# Altium schematic sheet CET-124-120W.SchDoc
size A4
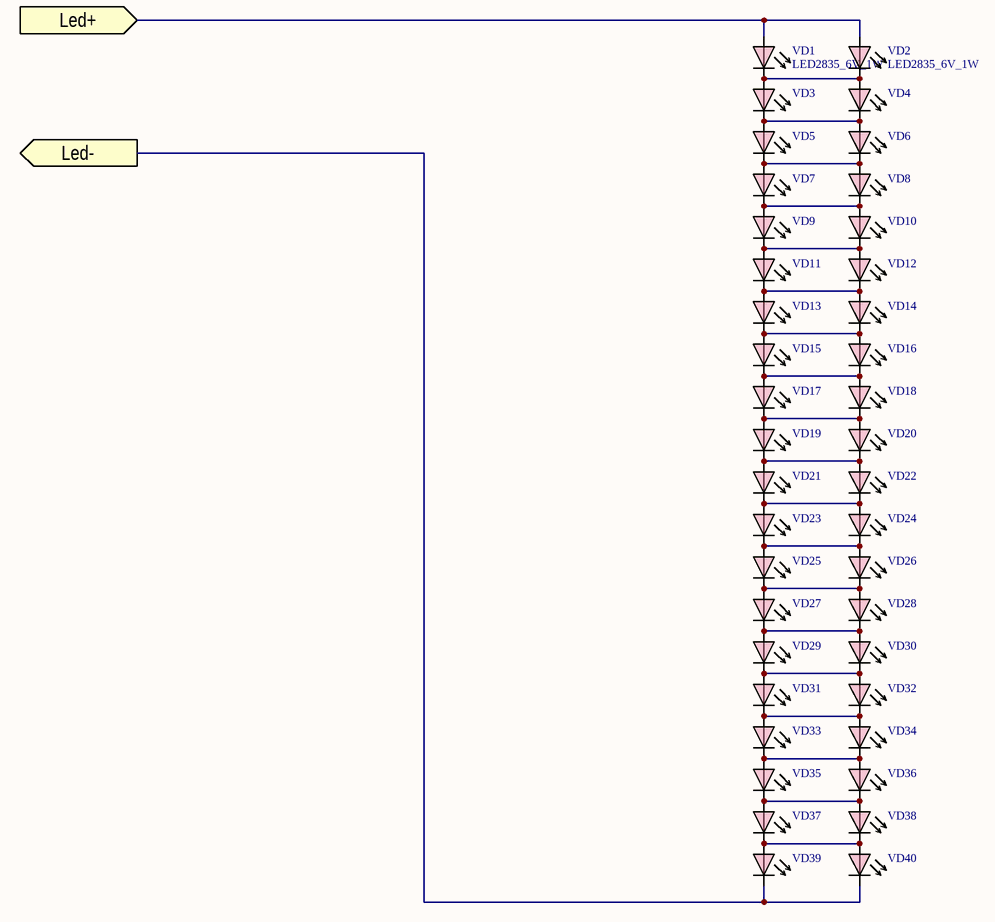
[diagram p0: CET-124-120W.SchDoc]

## Parts
VD1  LED2835_6V_1W  [2835]
VD2  LED2835_6V_1W  [2835]
VD3  LED2835_6V_1W  [2835]  (value not drawn)
VD4  LED2835_6V_1W  [2835]  (value not drawn)
VD5  LED2835_6V_1W  [2835]  (value not drawn)
VD6  LED2835_6V_1W  [2835]  (value not drawn)
VD7  LED2835_6V_1W  [2835]  (value not drawn)
VD8  LED2835_6V_1W  [2835]  (value not drawn)
VD9  LED2835_6V_1W  [2835]  (value not drawn)
VD10  LED2835_6V_1W  [2835]  (value not drawn)
VD11  LED2835_6V_1W  [2835]  (value not drawn)
VD12  LED2835_6V_1W  [2835]  (value not drawn)
VD13  LED2835_6V_1W  [2835]  (value not drawn)
VD14  LED2835_6V_1W  [2835]  (value not drawn)
VD15  LED2835_6V_1W  [2835]  (value not drawn)
VD16  LED2835_6V_1W  [2835]  (value not drawn)
VD17  LED2835_6V_1W  [2835]  (value not drawn)
VD18  LED2835_6V_1W  [2835]  (value not drawn)
VD19  LED2835_6V_1W  [2835]  (value not drawn)
VD20  LED2835_6V_1W  [2835]  (value not drawn)
VD21  LED2835_6V_1W  [2835]  (value not drawn)
VD22  LED2835_6V_1W  [2835]  (value not drawn)
VD23  LED2835_6V_1W  [2835]  (value not drawn)
VD24  LED2835_6V_1W  [2835]  (value not drawn)
VD25  LED2835_6V_1W  [2835]  (value not drawn)
VD26  LED2835_6V_1W  [2835]  (value not drawn)
VD27  LED2835_6V_1W  [2835]  (value not drawn)
VD28  LED2835_6V_1W  [2835]  (value not drawn)
VD29  LED2835_6V_1W  [2835]  (value not drawn)
VD30  LED2835_6V_1W  [2835]  (value not drawn)
VD31  LED2835_6V_1W  [2835]  (value not drawn)
VD32  LED2835_6V_1W  [2835]  (value not drawn)
VD33  LED2835_6V_1W  [2835]  (value not drawn)
VD34  LED2835_6V_1W  [2835]  (value not drawn)
VD35  LED2835_6V_1W  [2835]  (value not drawn)
VD36  LED2835_6V_1W  [2835]  (value not drawn)
VD37  LED2835_6V_1W  [2835]  (value not drawn)
VD38  LED2835_6V_1W  [2835]  (value not drawn)
VD39  LED2835_6V_1W  [2835]  (value not drawn)
VD40  LED2835_6V_1W  [2835]  (value not drawn)

## Ports
Led+ (in), Led- (out)

## Nets
Led+: VD1.1(A) VD2.1(A) ; port Led+
Led-: VD39.2(C) VD40.2(C) ; port Led-
NetVD1_2: VD1.2(C) VD2.2(C) VD3.1(A) VD4.1(A)
NetVD3_2: VD3.2(C) VD4.2(C) VD5.1(A) VD6.1(A)
NetVD5_2: VD5.2(C) VD6.2(C) VD7.1(A) VD8.1(A)
NetVD7_2: VD7.2(C) VD8.2(C) VD9.1(A) VD10.1(A)
NetVD9_2: VD9.2(C) VD10.2(C) VD11.1(A) VD12.1(A)
NetVD11_2: VD11.2(C) VD12.2(C) VD13.1(A) VD14.1(A)
NetVD13_2: VD13.2(C) VD14.2(C) VD15.1(A) VD16.1(A)
NetVD15_2: VD15.2(C) VD16.2(C) VD17.1(A) VD18.1(A)
NetVD17_2: VD17.2(C) VD18.2(C) VD19.1(A) VD20.1(A)
NetVD19_2: VD19.2(C) VD20.2(C) VD21.1(A) VD22.1(A)
NetVD21_2: VD21.2(C) VD22.2(C) VD23.1(A) VD24.1(A)
NetVD23_2: VD23.2(C) VD24.2(C) VD25.1(A) VD26.1(A)
NetVD25_2: VD25.2(C) VD26.2(C) VD27.1(A) VD28.1(A)
NetVD27_2: VD27.2(C) VD28.2(C) VD29.1(A) VD30.1(A)
NetVD29_2: VD29.2(C) VD30.2(C) VD31.1(A) VD32.1(A)
NetVD31_2: VD31.2(C) VD32.2(C) VD33.1(A) VD34.1(A)
NetVD33_2: VD33.2(C) VD34.2(C) VD35.1(A) VD36.1(A)
NetVD35_2: VD35.2(C) VD36.2(C) VD37.1(A) VD38.1(A)
NetVD37_2: VD37.2(C) VD38.2(C) VD39.1(A) VD40.1(A)

## Library data of the parts
VD1-VD40 = Светодиод: Value: LED2835_6V_1W